# EAGLE design working (EAGLE 9.6.2)
COMPANY: ADAFRUIT INDUSTRIES; DRAWN: KTOWN; REV: A
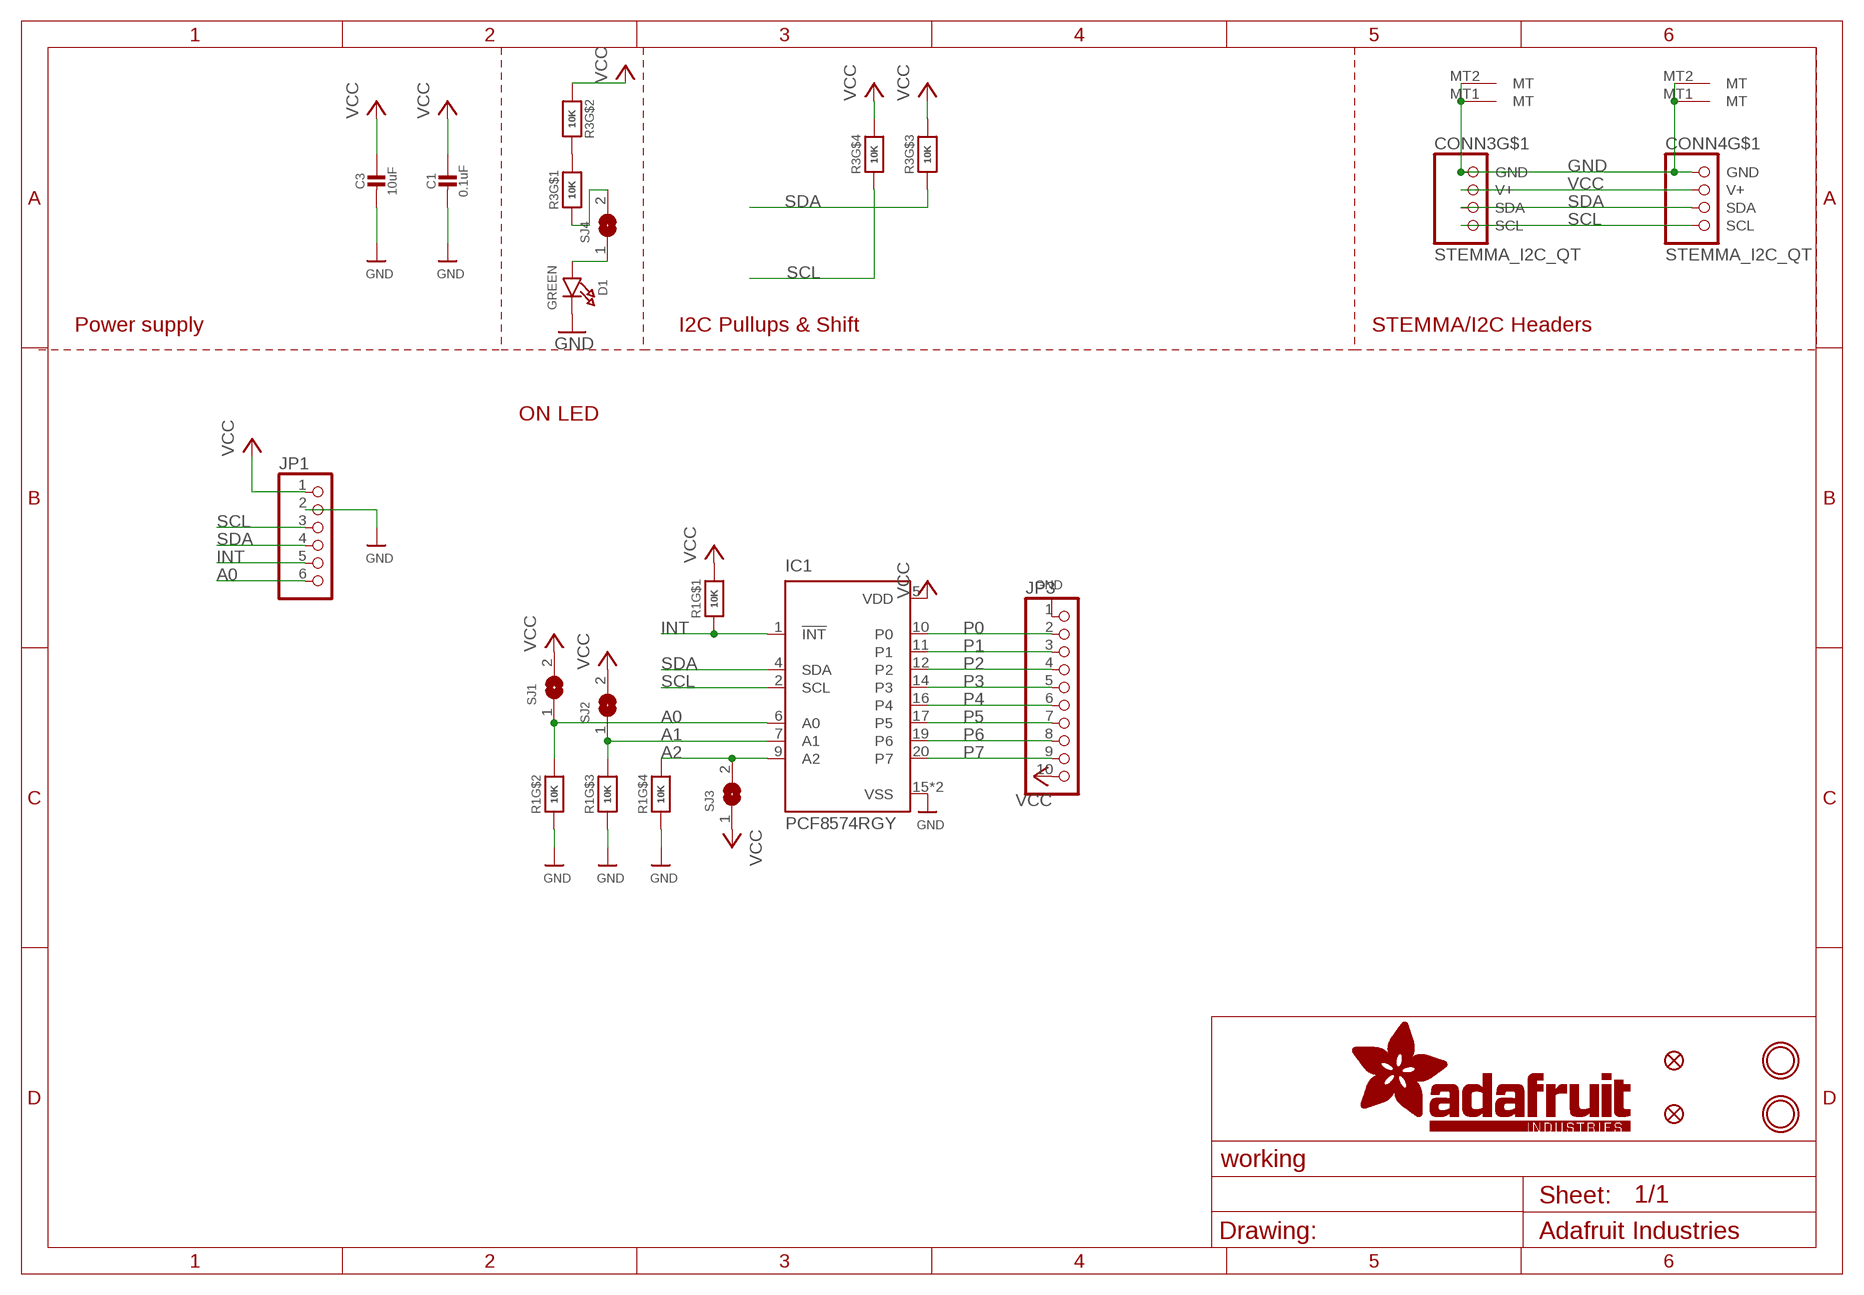
[diagram p0: schematic, sheet 1]

## Parts
C1  0.1uF  CAP_CERAMIC0603_NO  [0603-NO]
C3  10uF  CAP_CERAMIC0805-NOOUTLINE  [0805-NO]
CONN3  STEMMA_I2C_QT  [JST_SH4]
CONN4  STEMMA_I2C_QT  [JST_SH4]
D1  GREEN  LED0603_NOOUTLINE  [CHIPLED_0603_NOOUTLINE]
FID3  FIDUCIAL_1MM  [FIDUCIAL_1MM]
FID4  FIDUCIAL_1MM  [FIDUCIAL_1MM]
IC1  PCF8574RGY  [VQFN20_3.5X4.5]
JP1  HEADER-1X670MIL  [1X06_ROUND_70]
JP3  HEADER-1X1070MIL  [1X10_ROUND70]
R1  10K  RESISTOR_4PACK  [RESPACK_4X0603]
R3  10K  RESISTOR_4PACK  [RESPACK_4X0603]
SJ1  SOLDERJUMPER  [SOLDERJUMPER_ARROW_NOPASTE]
SJ2  SOLDERJUMPER  [SOLDERJUMPER_ARROW_NOPASTE]
SJ3  SOLDERJUMPER  [SOLDERJUMPER_ARROW_NOPASTE]
SJ4  SOLDERJUMPERCLOSED  [SOLDERJUMPER_CLOSEDWIRE]
U$19  MOUNTINGHOLE2.5  [MOUNTINGHOLE_2.5_PLATED]
U$21  MOUNTINGHOLE2.5  [MOUNTINGHOLE_2.5_PLATED]

## Nets
A0: IC1.6(A0) JP1.6 R1.7 SJ1.1
A1: IC1.7(A1) R1.6 SJ2.1
A2: IC1.9(A2) R1.5 SJ3.2
GND [highpower]: C1.2 C3.2 CONN3.1(GND) CONN3.MT1(MT) CONN3.MT2(MT) CONN4.1(GND) CONN4.MT1(MT) CONN4.MT2(MT) D1.C IC1.15(VSS) IC1.21(VSS) JP1.2 JP3.1 R1.2 R1.3 R1.4
INT: IC1.1(!INT) JP1.5 R1.1
N$1: R3.1 SJ4.2
N$2 [highpower]: R3.7 R3.8
N$3: D1.A SJ4.1
P0: IC1.10(P0) JP3.2
P1: IC1.11(P1) JP3.3
P2: IC1.12(P2) JP3.4
P3: IC1.14(P3) JP3.5
P4: IC1.16(P4) JP3.6
P5: IC1.17(P5) JP3.7
P6: IC1.19(P6) JP3.8
P7: IC1.20(P7) JP3.9
SCL: CONN3.4(SCL) CONN4.4(SCL) IC1.2(SCL) JP1.3 R3.4
SDA: CONN3.3(SDA) CONN4.3(SDA) IC1.4(SDA) JP1.4 R3.3
VCC [highpower]: C1.1 C3.1 CONN3.2(V+) CONN4.2(V+) IC1.5(VDD) JP1.1 JP3.10 R1.8 R3.2 R3.5 R3.6 SJ1.2 SJ2.2 SJ3.1

## Notes on the sheet
- Power supply | I2C Pullups & Shift | STEMMA/I2C Headers
- ON LED

## Library data of the parts
C1 C3 = microbuilder:CAP_CERAMIC: Ceramic Capacitors For new designs, use the packages preceded by an '_' character since they are more reliable: The following footprints should be used on most boards: _0402 - Standard footprint for regular board layouts _0603 - Standard footprint for regular board layouts _0805 - Standard footprint for regular board layouts _1206 - Standard footprint for regular board layouts For extremely tight-pitch boards where space is at a premium, the following 'micro-pitch' footprints can be used (smaller pads, no silkscreen outline, etc.): _0402MP - Micro-pitch footprint for very dense/compact boards _0603MP - Micro-pitch footprint for very dense/compact boards _0805MP - Micro-pitch footprint for very dense/compact boards _1206MP - Micro-pitch footprint for very dense/compact boards
CONN3 CONN4 = microbuilder:STEMMA_I2C
D1 = microbuilder:LED: LED 0603 - 0603 Surface Mount Package 2mA: Green LED - Low Power (3.9mcd, 2ma, 1.7Vf) - Digikey: 475-2709-2-ND Orange LED - Low Power (9.8mcd, 2ma, 1.8Vf) - Digikey: 475-1194-2-ND Red LED - Low Power (5mcd, 2ma, 1.8Vf) - Digikey: 475-1195-2-ND Yellow LED - Low Power (7mcd, 2ma, 1.8Vf) - Digikey: 475-1196-2-ND 5mA: Blue LED - Low Power (17mcd, 5ma, 2.9Vf) - Digikey: LNJ937W8CRACT-ND 0805 - 0805 Surface Mount Package 2mA: Red LED (8.8mcd, 2mA, 1.8Vf, Clear) - Low Power [Digikey: 475-2510-1-ND] Green LED (5mcd, 2mA, 1.8Vf, Clear) - Low Power [Digikey: 475-2730-1-ND] Yellow LED (11.3mcd, 2mA, 1.8Vf, Clear) - Low Power [Digikey: 475-2555-1-ND] 20mA: Red LED (104mcd, 20mA, Diffused) - LS R976 [Digikey: 475-1278-6-ND] Red LED (12mcd, 20mA, 2.0Vf, Clear) - APT2012EC [Digikey: 754-1128-1-ND] Green LED (15mcd, 20mA, 2.2Vf, Clear) - APT2012GC [Digikey: 754-1131-1-ND] Orange LED (160mcd, 20mA, 2.1Vf, Clear) - APT2012SECK [Digikey: 754-1130-1-ND] 1206 - 1206 Surface Mount Package Green LED (26mcd, 20mA, Diffused) - LG N971 [Digikey: 475-1407-6-ND] Red LED (15mcd, 20mA, Diffused) - LH N974 [Digikey: 475-1416-6-ND] Cree - Cree High-Power Surface Mount LEDs XPEBWT-L1-0000-00D50 - White 111lm 350mA 2.9Vf 6200K 110° XTEAWT-00-0000-00000LEE3 - White 114lm 350mA 2.85Vf 5000K 115° Everlight - Everlight 45-21 Series Surface Mount LEDs 45-21/QK2C-B2832AC2CB2/2T - Warm White 2000mcd 20mA 3.25Vf 3050K 120° 45-21/LK2C-B38452C4CB2/2T - Nuetral White 2000mcd 20mA 3.25Vf 4150K 120° 45-21/LK2C-B50634C6CB2/2T - Cold White 2200mcd 20mA 3.25Vf 5650K 120° PLCC2 Reverse Mount LS T77K-J1L2-1-0-2-R18-Z - Red 11.25mcd 2mA 1.8Vf 630nm 120° LO T77K-L1M2-24-Z - Orange 19.6mcd 2mA 1.8Vf 606nm 120° LY T77K-K2M1-26-Z - Yellow 15.7mcd 2mA 1.8Vf 587nm 120°
FID3 FID4 = microbuilder:FIDUCIAL: Fiducial Alignment Points Various fiducial points for machine vision alignment.; BOM: EXCLUDE
IC1 = adafruit_sensor:PCF8574: I2C-Bus Remote 8-bit I/O expander http://www.semiconductors.philips.com/acrobat_download/datasheets/PCF8574_4.pdf
JP1 = microbuilder:HEADER-1X6: PIN HEADER
JP3 = microbuilder:HEADER-1X10: PIN HEADER
R1 R3 = microbuilder:RESISTOR_4PACK: Resistor Packs (4 resistors) 4 x 0603 10K 1/16W - Digikey: YC164J-10KCT-ND
SJ1-SJ3 = microbuilder:SOLDERJUMPER: SMD Solder JUMPER Solder the two pads together to create a connection, or remove the solder to break it. REFLOW - Use this footprint for solder paste and reflow ovens. WAVE - Use this footprint for hand-soldering (larger pads). CLOSED - Has a trace between the two pads to ensure it is closed by default. The trace needs to be cut to disable the jumper, and can be closed again by creating a solder bridge between the two pads.; BOM: EXCLUDE
SJ4 = microbuilder:SOLDERJUMPER: SMD Solder JUMPER Solder the two pads together to create a connection, or remove the solder to break it. REFLOW - Use this footprint for solder paste and reflow ovens. WAVE - Use this footprint for hand-soldering (larger pads). CLOSED - Has a trace between the two pads to ensure it is closed by default. The trace needs to be cut to disable the jumper, and can be closed again by creating a solder bridge between the two pads.
U$19 U$21 = adafruit_electromech:MOUNTINGHOLE: Mounting Hole For #2 screws (0.086"/2.18mm width, 0.094"/2.4mm hole) use 2.5mm; BOM: EXCLUDE

## Net classes
1 highpower: width 0.305 mm, drill 0.483 mm
2 lowpower: width 0.254 mm, drill 0.483 mm

## Board
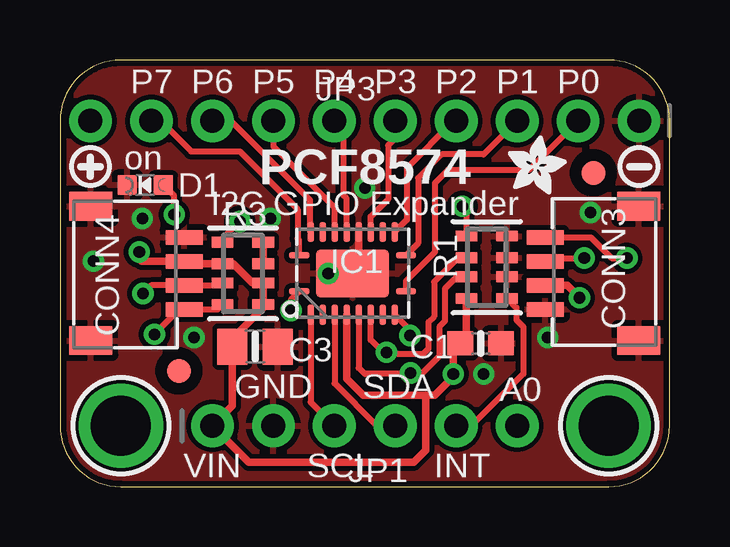
[diagram p1: board, top side]
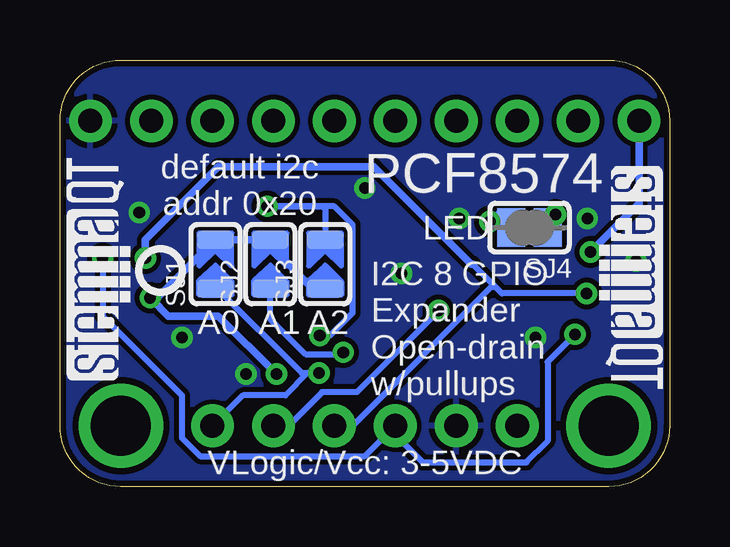
[diagram p2: board, bottom side, seen from below]

Size 25.4 x 17.78 mm. Coordinates in mm from the lower left corner, seen from the top.
Outline: 0,15.24 0,2.54 arc90 2.54,0 22.86,0 arc90 25.4,2.54 25.4,15.24 arc90 22.86,17.78 2.54,17.78 arc90 0,15.24
Copper layers (1*16): Top 0.035mm / dielectric 1.5mm / Bottom 0.035mm
Design rules "adafruit *": minimum track width 8mil, minimum drill 15.5mil, track to track 8mil, track to pad 8mil, pad to pad 8mil, via to via 8mil, smd to smd 8mil, copper to edge 10mil, drill to drill 8mil, minimum pad ring 10mil, minimum via ring 8mil, stop-mask expansion 2mil, vias tented up to drill 20mil, thermal gap 10mil

### Footprints (pad centres in the part's own frame; a part is rotated, then mirrored left to right if it is on the bottom)
0603-NO = smd 1.075 x 1: 1 -0.85,0; 2 0.85,0
0805-NO = smd 1.24 x 1.5: 1 -0.95,0; 2 0.95,0
JST_SH4 = smd 0.6 x 1.55: 1 -1.5,2.514; 2 -0.5,2.514; 3 0.5,2.514; 4 1.5,2.514 | smd 1.2 x 1.8: MT1 -2.8,-1.386; MT2 2.8,-1.386
CHIPLED_0603_NOOUTLINE = smd 0.8 x 0.8: A 0,-0.75; C 0,0.75
FIDUCIAL_1MM = smd 1 x 1: 1 0,0
VQFN20_3.5X4.5 = smd 0.28 x 0.85: 1 -0.75,2.225; 10 -0.75,-2.225; 11 0.75,-2.225; 20 0.75,2.225 | smd 0.85 x 0.28: 2 -1.725,1.75; 3 -1.725,1.25; 4 -1.725,0.75; 5 -1.725,0.25; 6 -1.725,-0.25; 7 -1.725,-0.75; 8 -1.725,-1.25; 9 -1.725,-1.75; 12 1.725,-1.75; 13 1.725,-1.25; 14 1.725,-0.75; 15 1.725,-0.25; 16 1.725,0.25; 17 1.725,0.75; 18 1.725,1.25; 19 1.725,1.75 | smd 2 x 3.05: 21 0,0
1X06_ROUND_70 = drill 1 pad 1.778: 1 -6.35,0; 2 -3.81,0; 3 -1.27,0; 4 1.27,0; 5 3.81,0; 6 6.35,0
1X10_ROUND70 = drill 1 pad 1.778: 1 -11.43,0; 2 -8.89,0; 3 -6.35,0; 4 -3.81,0; 5 -1.27,0; 6 1.27,0; 7 3.81,0; 8 6.35,0; 9 8.89,0; 10 11.43,0
RESPACK_4X0603 = smd 0.45 x 0.9: 1 -1.3,-0.85; 2 -0.4,-0.85; 3 0.4,-0.85; 4 1.3,-0.85; 5 1.3,0.85; 6 0.4,0.85; 7 -0.4,0.85; 8 -1.3,0.85
SOLDERJUMPER_ARROW_NOPASTE = smd 0.762 x 1.524: 1 -1.016,0; 2 1.016,0
SOLDERJUMPER_CLOSEDWIRE = smd 1.168 x 1.6: 1 -0.762,0; 2 0.762,0 | smd 0.635 x 0.203: WIRE 0,0
MOUNTINGHOLE_2.5_PLATED = drill 2.5 pad 3.2: P$1 0,0

### Placement (x,y rotation side)
C1  17.53,5.97 0 top
C3  8.13,5.84 0 top
CONN3  22.73,8.89 90 top
CONN4  2.67,8.89 270 top
D1  3.56,12.57 90 top
FID3  4.95,4.83 0 top
FID4  22.23,13.08 0 top
IC1  12.19,8.89 90 top
JP1  12.7,2.54 0 top
JP3  12.7,15.24 180 top
R1  17.78,9.14 90 top
R3  7.62,8.89 270 top
SJ1  18.92,9.27 90 bottom
SJ2  16.64,9.27 90 bottom
SJ3  14.35,9.27 90 bottom
SJ4  5.84,10.79 180 bottom
U$8  [ADAFRUIT_2.5MM]  18.67,12.19 0 top
U$9  [SYMBOL_MINUS]  24.13,13.34 0 top
U$11  [SYMBOL_PLUS]  1.27,13.34 0 top
U$19  2.54,2.54 0 top
U$21  22.86,2.54 0 top
U$25  [PCBFEAT-REV-040]  21.21,9.02 0 bottom
U$30  [STEMMAQT]  22.48,4.45 90 bottom
U$31  [STEMMAQT]  2.92,13.34 270 bottom

### Tracks (layer width: path | path; a pad name or v marks a point on that pad's centre or on a via)
A0  (via drill 0.48)
  Top 0.254: R1.7 16.53,8.74 16.04,8.26 16.04,6.9 15.81,6.66 15.81,5.44 15.11,4.75 v14.6,4.75 14.56,4.7 12.7,4.7 12.44,4.96 IC1.6
  Bottom 0.254: v14.6,4.75 15.07,4.75 | JP1.6 17.78,3.81 16,3.81 15.07,4.75 | 15.07,4.75 15.33,4.75 18.84,8.26 SJ1.1
A1  (via drill 0.48)
  Top 0.254: R1.6 16.59,9.54 15.58,8.54 15.58,7.09 15.35,6.85 15.35,5.76 15.11,5.52 13.54,5.52 | 13.54,5.52 12.94,6.12 IC1.7 | 13.54,5.52 13.52,5.52 v13.6,5.6
  Bottom 0.254: v13.6,5.6 13.68,5.52 15.17,5.52 16.64,6.99 SJ2.1
A2  (via drill 0.48)
  Top 0.254: v16.76,11.68 16.93,11.52 R1.5 | IC1.9 14.45,6.66 14.45,6.29 v14.58,6.29
  Bottom 0.254: SJ3.2 14.35,11.56 14.48,11.68 v16.76,11.68 13.97,11.68 13.21,10.92 13.21,7.24 14.15,6.29 v14.58,6.29
GND  (via drill 0.48)
  Top 0.305: IC1.21 12.44,9.14 IC1.15
  other vias: 12.7,12.45 17.65,4.7 20.32,6.22 22.1,11.43 3.43,11.18 5.59,6.22 11.18,8.89 1.4,9.4 8.76,11.18
  pour Top: 0,17.78 25.4,17.78 25.4,0 0,0
  pour Bottom: 0,17.78 25.4,17.78 25.4,0 0,0
INT  (via drill 0.48)
  Top 0.254: R1.1 19.01,7.46 19.01,6.96 19.3,6.66 19.3,4.7 17.14,2.54 JP1.5 | IC1.1 9.63,7.8 v9.63,7.34
  Bottom 0.254: v9.63,7.34 13.03,3.94 14.48,3.94 15.88,2.54 JP1.5
N$1  (via drill 0.48)
  Top 0.254: R3.1 6.77,10.33 v7.49,11.05
  Bottom 0.254: v7.49,11.05 7.11,11.43 6.6,10.92 SJ4.2
N$2
  Top 0.305: R3.8 R3.7
N$3  (via drill 0.48)
  Top 0.254: v4.76,11.34 4.76,12.12 D1.A
  Bottom 0.254: v4.76,11.34 4.83,11.27 4.83,11.05 SJ4.1
P0
  Top 0.254: JP3.2 19.56,13.21 16.17,13.21 15.62,12.65 15.62,9.78 14.42,8.57 IC1.10
P1
  Top 0.254: JP3.3 17.65,13.84 15.91,13.84 14.93,12.85 14.93,10.15 IC1.11
P2
  Top 0.254: JP3.4 16.41,15.24 14.45,13.28 14.45,11.12 IC1.12
P3
  Top 0.254: IC1.14 12.94,11.25 13.67,11.98 13.67,14.22 13.97,14.52 JP3.5
P4
  Top 0.254: IC1.16 11.94,12.01 11.81,12.14 11.81,14.86 JP3.6
P5
  Top 0.254: IC1.17 11.44,11.63 8.89,14.18 JP3.7
P6
  Top 0.254: JP3.8 7.12,15.24 10.41,11.95 10.41,10.64 IC1.19
P7
  Top 0.254: JP3.9 4.19,15.24 5.46,13.97 7.49,13.97 9.91,11.56 9.91,10.34 9.97,10.28 IC1.20
SCL  (via drill 0.48)
  Top 0.254: IC1.2 10.44,3.53 JP1.3 | R3.4 6.57,7.39 CONN4.4 4.98,7.39 v3.94,6.35 | CONN3.4 22.12,10.39 22.99,9.53 v23.62,9.53
  Bottom 0.254: v3.94,6.35 5.08,5.21 5.08,1.91 5.97,1.02 10.29,1.02 11.43,2.16 JP1.3 12.7,1.27 19.56,1.27 20.32,2.03 20.32,3.81 23.62,7.11 v23.62,9.53
SDA  (via drill 0.48)
  Top 0.254: IC1.4 11.44,4.31 13.21,2.54 JP1.4 | R3.3 6.67,8.39 CONN4.3 3.8,8.39 v3.46,8.05 | CONN3.3 20.35,9.53 v21.84,9.53
  Bottom 0.254: v3.46,8.05 6.99,8.05 7.24,8.31 | 7.24,8.31 7.44,8.31 13.21,2.54 JP1.4 | 7.24,8.31 8.2,9.27
  Bottom 0.305: 8.2,9.27 8.26,9.27 12.32,13.34 18.8,13.34 21.84,10.29 v21.84,9.53
VCC  (via drill 0.48)
  Top 0.305: IC1.5 11.94,4.5 12.63,3.81 15.24,3.81 | R1.8 16.93,6.19 16.71,5.97 C1.1 16.39,5.68 v16.39,4.7 16.39,4.57 15.62,3.81 15.24,3.81 | v3.3,9.78 3.3,9.49 3.4,9.39 CONN4.2 5.28,9.29 R3.2 7.22,9.29 8.02,8.49 R3.6 R3.5 8.47,7.45 7.18,6.16 C3.1 7.18,3.37 JP1.1 7.87,1.02 14.73,1.02 15.24,1.52 15.24,3.81 | CONN3.2 21.13,8.39 v21.64,7.87
  Bottom 0.305: 21.59,7.82 v21.64,7.87 | SJ3.1 14.86,8.26 16.64,10.03 SJ2.2 SJ1.2 21.39,7.82 21.59,7.82 | v3.3,9.78 1.27,11.81 JP3.10 | v16.39,4.7 18.8,7.11 20.88,7.11 21.59,7.82

### Text on the board
tPlace: P7 | P6 | P5 | P4 | P3 | P2 | P1 | P0 | on | PCF8574 | I2C GPIO Expander | GND | SDA | A0 | VIN | SCL | INT
bPlace: PCF8574 | default i2c / addr 0x20 | LED | I2C 8 GPIO / Expander / Open-drain / w/pullups | A2 | A1 | A0 | VLogic/Vcc: 3-5VDC